# Altium schematic sheet Sheet2.SchDoc
size A4
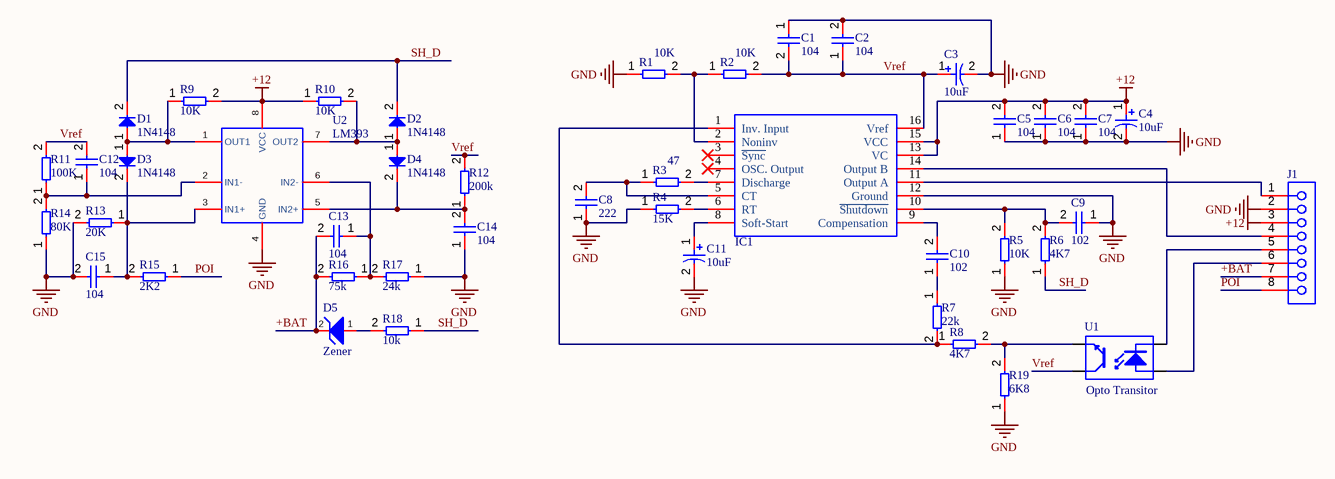
[diagram p0: Sheet2.SchDoc]

## Parts
C1  104  [C0805]
C2  104  [C0805]
C3  10uF  [CAP_RAD_4mm]
C4  10uF  [CAP_RAD_4mm]
C5  104  [C0805]
C6  104  [C0805]
C7  104  [C0805]
C8  222  [C0805]
C9  102  [C0805]
C10  102  [C0805]
C11  10uF  [CAP_RAD_4mm]
C12  104  [C0805]
C13  104  [C0805]
C14  104  [C0805]
C15  104  [C0805]
D1  1N4148  [SOD-80]
D2  1N4148  [SOD-80]
D3  1N4148  [SOD-80]
D4  1N4148  [SOD-80]
D5  Zener  [DO-213AB]
IC1  Pulse width modulator control circuits  [SO16]  (value not drawn)
J1  Header 8x1 TH Pitch 2.54mm  [Header 8x1 TH Pitch 2.54mm]  (value not drawn)
R1  10K  [R0805]
R2  10K  [R0805]
R3  47  [R0805]
R4  15K  [R0805]
R5  10K  [R0805]
R6  4K7  [R0805]
R7  22k  [R0805]
R8  4K7  [R0805]
R9  10K  [R0805]
R10  10K  [R0805]
R11  100K  [R0805]
R12  200k  [R0805]
R13  20K  [R0805]
R14  80K  [R0805]
R15  2K2  [R0805]
R16  75k  [R0805]
R17  24k  [R0805]
R18  10k  [R0805]
R19  6K8  [R0805]
U1  Opto Transitor  [DIP 4]
U2  LM393  [SOIC08_1.27_6.0]

## Nets
+12: C4.1 C5.2 C6.2 C7.2 IC1.13(VC) IC1.15(VCC) J1.3 R9.2 R10.1 U2.8(VCC)
GND: C1.1 C2.2 C3.2 C4.2 C5.1 C6.1 C7.1 C8.1 C9.1 C11.2 C14.1 C15.2 IC1.12(Ground) J1.2 R1.1 R4.1 R5.1 R13.2 R14.1 R17.1 R19.1 U2.4(GND)
+BAT: C13.2 D5.2(K) J1.7 R16.2
POI: J1.8 R15.1
SH_D: D1.2 D2.2 R6.1 R18.1
Vref: C1.2 C2.1 C3.1 C12.2 IC1.16(Vref) R2.2 R11.2 R12.2 U1.4(C)
NetC8_2: C8.2 IC1.5(CT) R3.1
NetC9_2: C9.2 IC1.10(~{Shutdown}) R5.2 R6.2
NetC10_1: C10.1 R7.1
NetC10_2: C10.2 IC1.9(Compensation)
NetC11_1: C11.1 IC1.8(Soft-Start)
NetC12_1: C12.1 R11.1 R14.2 U2.2(IN1-)
NetC13_1: C13.1 R16.1 R17.2 U2.6(IN2-)
NetC14_2: C14.2 D4.2 R12.1 U2.5(IN2+)
NetC15_1: C15.1 D3.2 R13.1 R15.2 U2.3(IN1+)
NetD1_1: D1.1 D3.1 R9.1 U2.1(OUT1)
NetD2_1: D2.1 D4.1 R10.2 U2.7(OUT2)
NetD5_1: D5.1(A) R18.2
NetIC1_1: IC1.1(Inv._Input) R7.2 R8.1
NetIC1_2: IC1.2(Noninv) R1.2 R2.1
NetIC1_6: IC1.6(RT) R4.2
NetIC1_7: IC1.7(Discharge) R3.2
NetIC1_11: IC1.11(Output_A) J1.1
NetIC1_14: IC1.14(Output_B) J1.4
NetJ1_5: J1.5 U1.2(K)
NetJ1_6: J1.6 U1.1(A)
NetR8_2: R8.2 R19.2 U1.3(E)

Not connected (* = marked no-connect by the designer): IC1 3(~{Sync})* 4(OSC._Output)*

## Library data of the parts
C1 C2 C5-C10 C12-C15 = C0805
C3 C4 C11 = Capacitor(Radian)
D1-D4 = 1N4148 (SOD-80)
D5 = Diode Zener
IC1 = SG3525AN
R1-R19 = Resistor SMD
U1 = Opto Transitor: Published: 24-Mar-1999; LatestRevisionDate: 04-Mar-2005; LatestRevisionNote: Sch pins 3 & 4 Swapped.; DatasheetVersion: Nov-2003; PackageReference: DIP-4; Publisher: Altium Limited